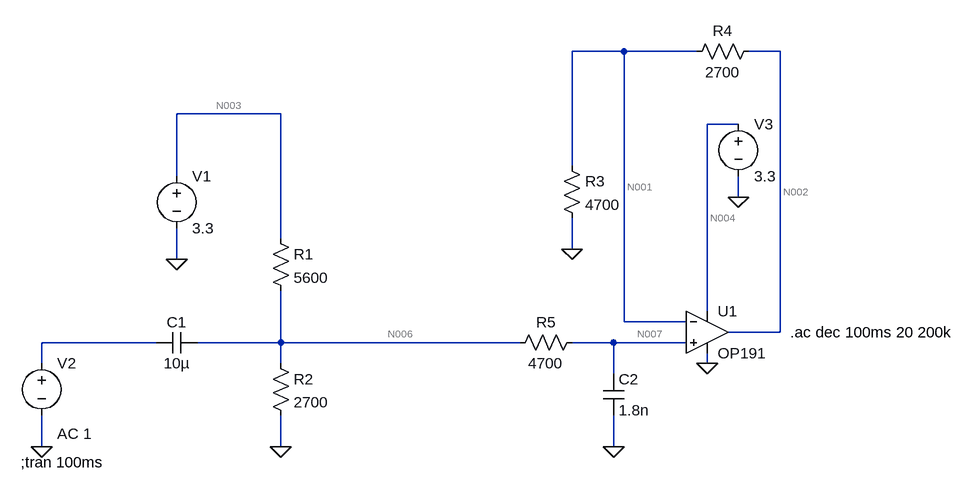
[diagram p0: schematic Draft1.asc]
Draft1.asc, the LTspice schematic file:
Version 4
SHEET 1 968 680
WIRE 448 -272 368 -272
WIRE 560 -272 448 -272
WIRE 688 -272 640 -272
WIRE -80 -176 -240 -176
WIRE 624 -160 576 -160
WIRE 368 -96 368 -272
WIRE -240 -80 -240 -176
WIRE 624 -48 624 -80
WIRE -80 16 -80 -176
WIRE 368 32 368 -16
WIRE -240 48 -240 0
WIRE 576 128 576 -160
WIRE 448 144 448 -272
WIRE 544 144 448 144
WIRE 688 160 688 -272
WIRE 688 160 608 160
WIRE -272 176 -448 176
WIRE -80 176 -80 96
WIRE -80 176 -208 176
WIRE 288 176 -80 176
WIRE 432 176 368 176
WIRE 544 176 432 176
WIRE -448 208 -448 176
WIRE -80 208 -80 176
WIRE 576 208 576 192
WIRE 432 224 432 176
WIRE -448 336 -448 288
WIRE -80 336 -80 288
WIRE 432 336 432 288
FLAG -240 48 0
FLAG -80 336 0
FLAG -448 336 0
FLAG 576 208 0
FLAG 624 -48 0
FLAG 368 32 0
FLAG 432 336 0
SYMBOL res -96 0 R0
SYMATTR InstName R1
SYMATTR Value 5600
SYMBOL res -96 192 R0
SYMATTR InstName R2
SYMATTR Value 2700
SYMBOL voltage -240 -96 R0
WINDOW 123 0 0 Left 0
WINDOW 39 0 0 Left 0
SYMATTR InstName V1
SYMATTR Value 3.3
SYMBOL voltage -448 192 R0
WINDOW 123 24 124 Left 2
WINDOW 39 0 0 Left 0
SYMATTR Value2 AC 1
SYMATTR InstName V2
SYMATTR Value ""
SYMBOL cap -208 160 R90
WINDOW 0 0 32 VBottom 2
WINDOW 3 32 32 VTop 2
SYMATTR InstName C1
SYMATTR Value 10µ
SYMBOL voltage 624 -176 R0
WINDOW 123 0 0 Left 0
WINDOW 39 0 0 Left 0
SYMATTR InstName V3
SYMATTR Value 3.3
SYMBOL res 352 -112 R0
SYMATTR InstName R3
SYMATTR Value 4700
SYMBOL res 656 -288 R90
WINDOW 0 0 56 VBottom 2
WINDOW 3 32 56 VTop 2
SYMATTR InstName R4
SYMATTR Value 2700
SYMBOL Opamps\\OP191 576 96 R0
SYMATTR InstName U1
SYMBOL res 384 160 R90
WINDOW 0 0 56 VBottom 2
WINDOW 3 32 56 VTop 2
SYMATTR InstName R5
SYMATTR Value 4700
SYMBOL cap 416 224 R0
SYMATTR InstName C2
SYMATTR Value 1.8n
TEXT -480 360 Left 2 !;tran 100ms
TEXT 704 160 Left 2 !.ac dec 100ms 20 200k

The netlist it stands for:
* Draft1.asc
R1 N003 N006 5600
R2 N006 0 2700
V1 N003 0 3.3
V2 N005 0 AC 1
C1 N006 N005 10µ
V3 N004 0 3.3
R3 N001 0 4700
R4 N002 N001 2700
XU1 N007 N001 N004 0 N002 OP191  ; pins In+ In- V+ V- OUT
R5 N007 N006 4700
C2 N007 0 1.8n
;tran 100ms
.ac dec 100ms 20 200k
.lib ADI.lib
.backanno
.end

* Results of the author's LTspice run, read from the files saved beside the schematic
* Operating Point, zero values left out:
*   V(n003) = 3.3 V
*   V(n006) = 1.074 V
*   V(n004) = 3.3 V
*   V(n001) = 1.074 V
*   V(n002) = 1.69 V
*   V(n007) = 1.074 V
*   I(R5) = 29.95 nA
*   I(R4) = 228.4 µA
*   I(R3) = 228.4 µA
*   I(R2) = 397.6 µA
*   I(R1) = 397.6 µA
*   I(V3) = -458.2 µA
*   I(V1) = -397.6 µA
*   Ix(u1:1) = -29.95 nA
*   Ix(u1:2) = -30.06 nA
*   Ix(u1:99) = 458.2 µA
*   Ix(u1:50) = -229.8 µA
*   Ix(u1:45) = -228.4 µA
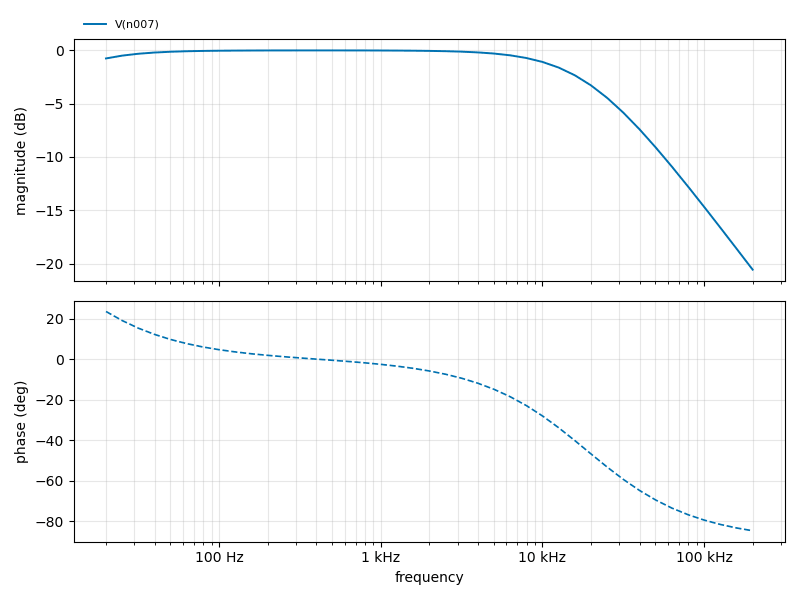
[diagram p1: AC Analysis of Draft1.asc, plotted from the saved traces]
* AC Analysis, 1 run:
*   V(n007): -0.76 dB at 20 Hz, -20.57 dB at 200 kHz, peak -0.01 dB at 399.1 Hz, 3 dB below the peak at 18.73 kHz